# Altium schematic sheet POWER_SUPPLY.SchDoc: Carte mère embarquée - Power Supply
size A3; Author: B Labbe; CompanyName: Oufffteam; DrawnBy: B Labbe; Engineer: B Labbe; Organization: Oufffteam; Address1: L3, 12a Rodborough Rd; Address2: Frenchs Forest; Address3: NSW; Address4: Australia 2086; Revision: A; SheetNumber: 5; SheetTotal: 6; DocumentName: Carte mère embarquée - Power Supply
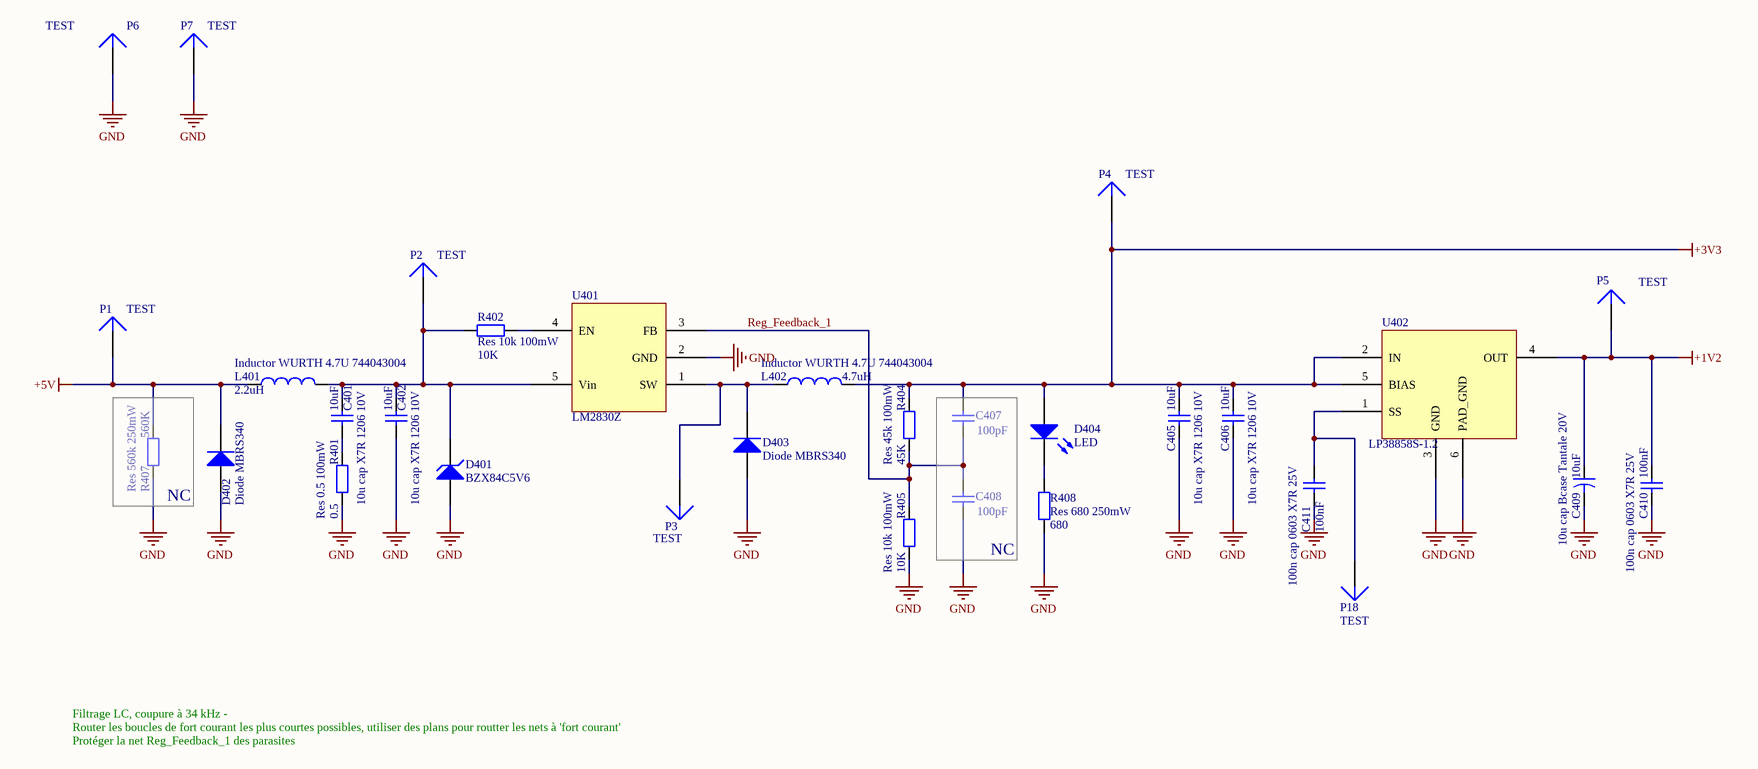
[diagram p0: POWER_SUPPLY.SchDoc]

## Parts
C401  10u cap X7R 1206 10V  value 10uF  [3216[1206]]
C402  10u cap X7R 1206 10V  value 10uF  [3216[1206]]
C405  10u cap X7R 1206 10V  value 10uF  [3216[1206]]
C406  10u cap X7R 1206 10V  value 10uF  [3216[1206]]
C407  value 100pF  [1608[0603]]  (hidden comment: 100p cap 0603 X7R 25V)
C408  value 100pF  [1608[0603]]  (hidden comment: 100p cap 0603 X7R 25V)
C409  10u cap Bcase Tantale 20V  value 10uF  [6032]
C410  100n cap 0603 X7R 25V  value 100nF  [1608[0603]]
C411  100n cap 0603 X7R 25V  value 100nF  [1608[0603]]
D401  BZX84C5V6  [318-07]
D402  Diode MBRS340  [SMC]
D403  Diode MBRS340  [SMC]
D404  LED  [1608[0603]]
L401  Inductor WURTH 4.7U 744043004  value 2.2uH  [744043004]
L402  Inductor WURTH 4.7U 744043004  value 4.7uH  [744043004]
P1  TEST  [TP1]
P2  TEST  [TP1]
P3  TEST  [TP1]
P4  TEST  [TP1]
P5  TEST  [TP1]
P6  TEST  [PIN1]
P7  TEST  [PIN1]
P18  TEST  [TP1]
R401  Res 0.5 100mW  value 0.5  [1608[0603]]
R402  Res 10k 100mW  value 10K  [1608[0603]]
R404  Res 45k 100mW  value 45K  [1608[0603]]
R405  Res 10k 100mW  value 10K  [1608[0603]]
R407  Res 560k 250mW  value 560K  [3216[1206]]
R408  Res 680 250mW  value 680  [1608[0603]]
U401  LM2830Z  [DBV005]
U402  LP38858S-1.2  [TO263-5Lead]

## Blocks framed on the sheet
NC: R407
NC: C407 C408

## Nets
+1V2: C409.1 C410.2 P5.1 U402.4(OUT)
+3V3: C405.2 C406.2 C407.2 D404.1(A) L402.2 P4.1 R404.2 U402.2(IN) U402.5(BIAS)
+5V: D402.2(K) L401.1 P1.1 R407.2
GND: C402.1 C405.1 C406.1 C408.1 C409.2 C410.1 C411.1 D401.1(A) D402.1(A) D403.1(A) P6.1 P7.1 R401.1 R405.1 R407.1 R408.1 U401.2(GND) U402.3(GND) U402.6(PAD_GND)
Reg_Feedback_1: C407.1 C408.2 R404.1 R405.2 U401.3(FB)
NetC401_1: C401.1 R401.2
NetC401_2: C401.2 C402.2 D401.3(K) L401.2 P2.1 R402.1 U401.5(Vin)
NetC411_2: C411.2 P18.1 U402.1(SS)
NetD403_2: D403.2(K) L402.1 P3.1 U401.1(SW)
NetD404_2: D404.2(K) R408.2
NetR402_2: R402.2 U401.4(EN)

## Notes on the sheet
- Router les boucles de fort courant les plus courtes possibles, utiliser des plans pour routter les nets à 'fort courant'
- Protéger la net Reg_Feedback_1 des parasites
- Filtrage LC, coupure à 34 kHz -
- Title
- Size:
- Date:
- A3
- Number:
- Time:
- Revision:
- Sheet
- of
- Oufffteam
- 3 place Carnot
- 26100
- Romans sur Isère
- oufffteam@gmail.com
- File:

## Library data of the parts
C401 C402 C405-C408 C410 C411 = Cap: Capacitor; Published: 8-Jun-2000; LatestRevisionDate: 17-Jul-2002; LatestRevisionNote: Re-released for DXP Platform.; PackageReference: RAD-0.3; Publisher: Altium Limited
C409 = Cap2: Capacitor; Published: 23-Sep-2002; PackageReference: CAPR5-4X5; Publisher: Altium Limited
D401 = BZX84C5V6LT1: Zener Voltage Regulator Diode; Note: Pin 2 is not connected and not drawn.; Published: 29-Sep-2000; LatestRevisionDate: 17-Jul-2002; LatestRevisionNote: Re-released for DXP Platform.; PackageReference: 318-07; Publisher: Altium Limited; PackageDescription: SOT-23; 3 Leads; Body 3.0 x 2.5 mm, inc. leads (LxW max); ComponentLink1Description: Manufacturer Link; ComponentLink1URL: http://www.onsemi.com/site/products/landing?taxonomyID=194; ComponentLink2Description: Datasheet; ComponentLink2URL: http://www.onsemi.com/pub/Collateral/BZX84C2V4LT1-D.PDF
D402 D403 = Diode: SCHOTTKY 3A DIODE; Published: 8-Jun-2000; LatestRevisionDate: 17-Jul-2002; LatestRevisionNote: Re-released for DXP Platform.; PackageDocument: Sep-1996; PackageReference: SMC; Publisher: Altium Limited; Code_JEDEC: DO-214-AB
D404 = LED0: LED SML-311DTT86; Published: 8-Jun-2000; LatestRevisionDate: 08-Jul-2005; LatestRevisionNote: Mech Layer 1 removed.; PackageReference: LED-0; Publisher: Altium Limited
L401 L402 = Inductor: Code_IEC: 1005; Published: 8-Jun-2000; LatestRevisionDate: 17-Jul-2002; LatestRevisionNote: Re-released for DXP Platform.; PackageReference: 0402-A; Publisher: Altium Limited; Code_JEITA: 0402
P1-P7 P18 = Plug: LatestRevisionDate: 17-Jul-2002; LatestRevisionNote: Re-released for DXP Platform.; Publisher: Altium Limited
R401 R402 R404 R405 R407 R408 = Res2: Resistor; Published: 8-Jun-2000; LatestRevisionDate: 17-Jul-2002; LatestRevisionNote: Re-released for DXP Platform.; PackageReference: AXIAL-0.4; Publisher: Altium Limited
U401 = LM2830: High Frequency 1.0A Load - Step-Down DC-DC Regulator
U402 = LP38858: 1.5A Fast-Reponse High-Accuracy LDO Linear Regulator with Soft-Start